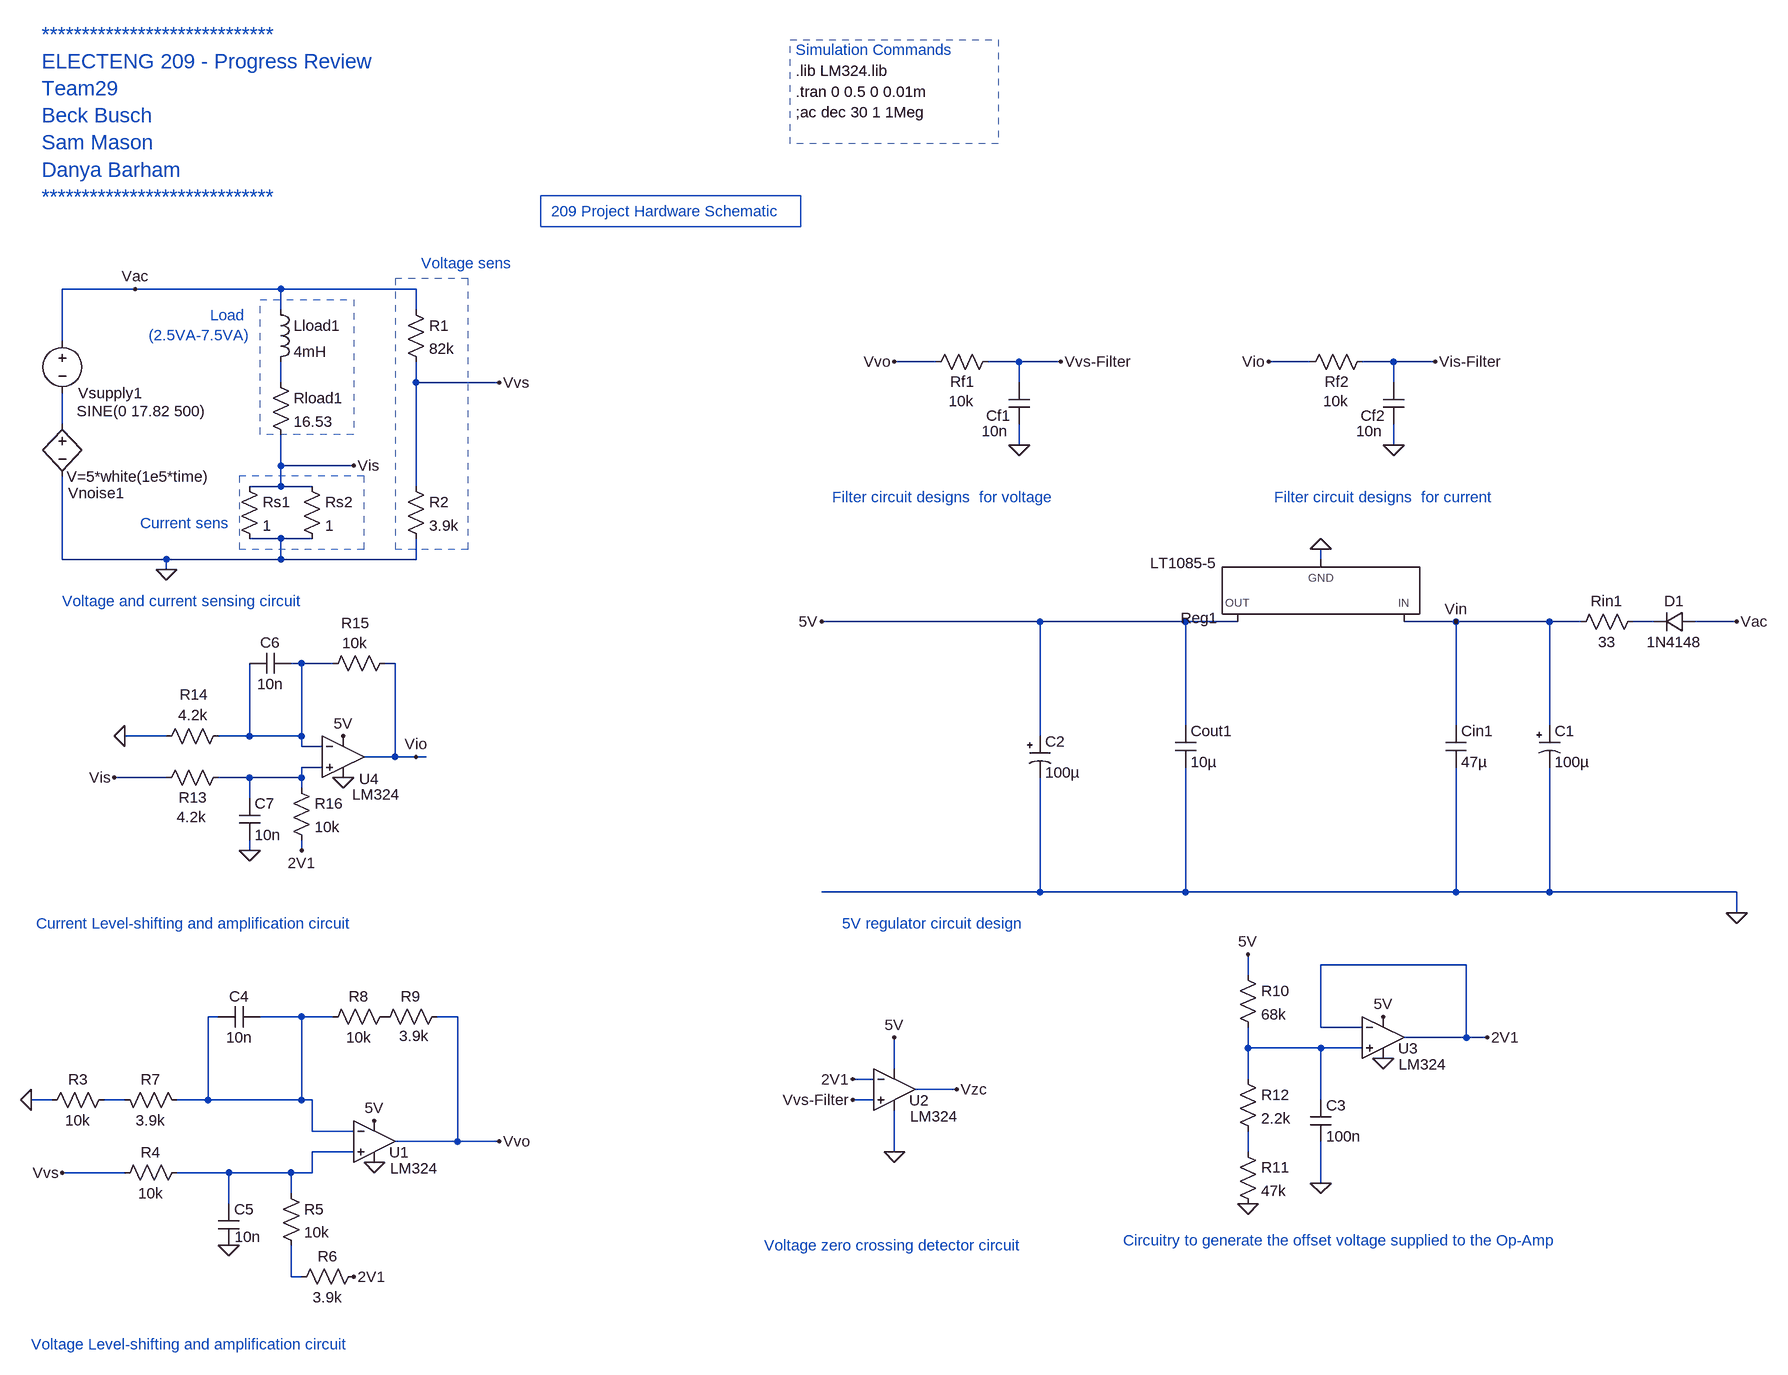
[diagram p0: schematic final-ltspice.asc]
final-ltspice.asc, the LTspice schematic file:
Version 4
SHEET 1 2620 1208
WIRE 96 -432 -16 -432
WIRE 320 -432 96 -432
WIRE 528 -432 320 -432
WIRE 320 -400 320 -432
WIRE 528 -400 528 -432
WIRE -16 -352 -16 -432
WIRE 1328 -320 1264 -320
WIRE 1456 -320 1408 -320
WIRE 1520 -320 1456 -320
WIRE 1904 -320 1840 -320
WIRE 2032 -320 1984 -320
WIRE 2096 -320 2032 -320
WIRE 320 -288 320 -320
WIRE 528 -288 528 -320
WIRE 656 -288 528 -288
WIRE 1456 -288 1456 -320
WIRE 2032 -288 2032 -320
WIRE -16 -224 -16 -272
WIRE 1456 -192 1456 -224
WIRE 2032 -192 2032 -224
WIRE 320 -160 320 -208
WIRE 432 -160 320 -160
WIRE 320 -128 320 -160
WIRE 320 -128 272 -128
WIRE 368 -128 320 -128
WIRE 528 -128 528 -288
WIRE 320 -48 272 -48
WIRE 368 -48 320 -48
WIRE -16 -16 -16 -144
WIRE 144 -16 -16 -16
WIRE 320 -16 320 -48
WIRE 320 -16 144 -16
WIRE 528 -16 528 -48
WIRE 528 -16 320 -16
WIRE 1920 -16 1920 -32
WIRE 144 0 144 -16
WIRE 1488 80 1152 80
WIRE 1712 80 1488 80
WIRE 1792 80 1712 80
WIRE 2128 80 2048 80
WIRE 2272 80 2128 80
WIRE 2320 80 2272 80
WIRE 2432 80 2400 80
WIRE 2560 80 2496 80
WIRE 352 144 336 144
WIRE 400 144 352 144
WIRE 496 144 480 144
WIRE 1712 240 1712 80
WIRE 2128 240 2128 80
WIRE 2272 240 2272 80
WIRE 144 256 80 256
WIRE 272 256 272 144
WIRE 272 256 224 256
WIRE 352 256 352 144
WIRE 352 256 272 256
WIRE 1488 256 1488 80
WIRE 352 272 352 256
WIRE 384 272 352 272
WIRE 496 288 496 144
WIRE 496 288 448 288
WIRE 528 288 496 288
WIRE 544 288 528 288
WIRE 384 304 352 304
WIRE 144 320 64 320
WIRE 272 320 224 320
WIRE 352 320 352 304
WIRE 352 320 272 320
WIRE 352 336 352 320
WIRE 272 352 272 320
WIRE 272 432 272 416
WIRE 352 432 352 416
WIRE 1488 496 1488 320
WIRE 1488 496 1152 496
WIRE 1712 496 1712 304
WIRE 1712 496 1488 496
WIRE 2128 496 2128 304
WIRE 2128 496 1712 496
WIRE 2272 496 2272 304
WIRE 2272 496 2128 496
WIRE 2560 496 2272 496
WIRE 2560 528 2560 496
WIRE 2144 608 1920 608
WIRE 1808 624 1808 592
WIRE 224 688 208 688
WIRE 352 688 288 688
WIRE 400 688 352 688
WIRE 592 688 560 688
WIRE 1920 704 1920 608
WIRE 1984 704 1920 704
WIRE 2144 720 2144 608
WIRE 2144 720 2048 720
WIRE 2176 720 2144 720
WIRE 1808 736 1808 704
WIRE 1920 736 1808 736
WIRE 1984 736 1920 736
WIRE 1264 768 1264 720
WIRE 1232 784 1200 784
WIRE 1808 784 1808 736
WIRE 1360 800 1296 800
WIRE -32 816 -64 816
WIRE 80 816 48 816
WIRE 208 816 208 688
WIRE 208 816 160 816
WIRE 352 816 352 688
WIRE 352 816 208 816
WIRE 368 816 352 816
WIRE 1232 816 1200 816
WIRE 1920 816 1920 736
WIRE 368 864 368 816
WIRE 432 864 368 864
WIRE 592 880 592 688
WIRE 592 880 496 880
WIRE 656 880 592 880
WIRE 432 896 368 896
WIRE 1264 896 1264 832
WIRE 1808 896 1808 864
WIRE 80 928 -16 928
WIRE 240 928 160 928
WIRE 336 928 240 928
WIRE 368 928 368 896
WIRE 368 928 336 928
WIRE 1920 944 1920 880
WIRE 336 960 336 928
WIRE 240 976 240 928
WIRE 240 1040 240 1024
WIRE 336 1088 336 1040
WIRE 352 1088 336 1088
FLAG 96 -432 Vac
FLAG 432 -160 Vis
FLAG 144 0 0
FLAG -64 816 0
FLAG 464 848 5V
FLAG 464 912 0
FLAG 432 1088 2V1
FLAG 656 880 Vvo
FLAG -16 928 Vvs
FLAG 656 -288 Vvs
FLAG 1456 -192 0
FLAG 1520 -320 Vvs-Filter
FLAG 2032 -192 0
FLAG 2096 -320 Vis-Filter
FLAG 1264 -320 Vvo
FLAG 1840 -320 Vio
FLAG 1152 80 5V
FLAG 1920 -32 0
FLAG 1264 896 0
FLAG 1264 720 5V
FLAG 1360 800 Vzc
FLAG 2128 80 Vin
FLAG 2560 80 Vac
FLAG 2560 528 0
FLAG 2176 720 2V1
FLAG 2016 688 5V
FLAG 2016 752 0
FLAG 1808 592 5V
FLAG 1808 976 0
FLAG 1920 944 0
FLAG 240 1040 0
FLAG 416 320 0
FLAG 416 256 5V
FLAG 528 288 Vio
FLAG 352 432 2V1
FLAG 80 256 0
FLAG 64 320 Vis
FLAG 272 432 0
FLAG 1200 784 2V1
FLAG 1200 816 Vvs-Filter
SYMBOL voltage -16 -368 R0
WINDOW 0 24 96 Left 2
WINDOW 3 22 124 Left 2
WINDOW 123 0 0 Left 0
WINDOW 39 0 0 Left 0
SYMATTR InstName Vsupply1
SYMATTR Value SINE(0 17.82 500)
SYMBOL res 304 -304 R0
SYMATTR InstName Rload1
SYMATTR Value 16.53
SYMBOL ind 304 -416 R0
SYMATTR InstName Lload1
SYMATTR Value 4mH
SYMBOL res 256 -144 R0
SYMATTR InstName Rs1
SYMATTR Value 1
SYMBOL res 352 -144 R0
SYMATTR InstName Rs2
SYMATTR Value 1
SYMBOL res 512 -416 R0
SYMATTR InstName R1
SYMATTR Value 82k
SYMBOL res 512 -144 R0
SYMATTR InstName R2
SYMATTR Value 3.9k
SYMBOL bv -16 -240 R0
WINDOW 0 9 122 Left 2
WINDOW 3 7 97 Left 2
SYMATTR InstName Vnoise1
SYMATTR Value V=5*white(1e5*time)
SYMBOL res 64 800 R90
WINDOW 0 0 56 VBottom 2
WINDOW 3 32 56 VTop 2
SYMATTR InstName R3
SYMATTR Value 10k
SYMBOL res 176 912 R90
WINDOW 0 0 56 VBottom 2
WINDOW 3 32 56 VTop 2
SYMATTR InstName R4
SYMATTR Value 10k
SYMBOL res 320 944 R0
SYMATTR InstName R5
SYMATTR Value 10k
SYMBOL res 448 1072 R90
WINDOW 0 0 56 VBottom 2
WINDOW 3 32 56 VTop 2
SYMATTR InstName R6
SYMATTR Value 3.9k
SYMBOL res 64 800 M90
WINDOW 0 0 56 VBottom 2
WINDOW 3 32 56 VTop 2
SYMATTR InstName R7
SYMATTR Value 3.9k
SYMBOL res 384 704 R270
WINDOW 0 32 56 VTop 2
WINDOW 3 0 56 VBottom 2
SYMATTR InstName R8
SYMATTR Value 10k
SYMBOL res 576 672 R90
WINDOW 0 0 56 VBottom 2
WINDOW 3 30 51 VTop 2
SYMATTR InstName R9
SYMATTR Value 3.9k
SYMBOL Opamps/opamp2 464 816 R0
WINDOW 0 23 81 Left 2
WINDOW 3 24 105 Left 2
SYMATTR InstName U1
SYMATTR Value LM324
SYMBOL res 1424 -336 R90
WINDOW 0 62 55 VBottom 2
WINDOW 3 61 57 VTop 2
SYMATTR InstName Rf1
SYMATTR Value 10k
SYMBOL cap 1472 -224 R180
WINDOW 0 29 13 Left 2
WINDOW 3 33 -11 Left 2
SYMATTR InstName Cf1
SYMATTR Value 10n
SYMBOL res 2000 -336 R90
WINDOW 0 62 55 VBottom 2
WINDOW 3 61 57 VTop 2
SYMATTR InstName Rf2
SYMATTR Value 10k
SYMBOL cap 2048 -224 R180
WINDOW 0 29 13 Left 2
WINDOW 3 33 -11 Left 2
SYMATTR InstName Cf2
SYMATTR Value 10n
SYMBOL cap 1696 240 R0
SYMATTR InstName Cout1
SYMATTR Value 10µ
SYMATTR SpiceLine Rser=0.001
SYMBOL PowerProducts/LT1085-5 1920 80 R180
SYMATTR InstName Reg1
SYMBOL Opamps/opamp2 1264 736 R0
WINDOW 0 23 81 Left 2
WINDOW 3 24 105 Left 2
SYMATTR InstName U2
SYMATTR Value LM324
SYMBOL polcap 2256 240 R0
WINDOW 3 24 56 Left 2
SYMATTR Value 100µ
SYMATTR InstName C1
SYMATTR Description Capacitor
SYMATTR Type cap
SYMATTR SpiceLine V=6.3 Irms=445m Rser=0.17 Lser=0
SYMBOL res 2304 96 R270
WINDOW 0 32 56 VTop 2
WINDOW 3 0 56 VBottom 2
SYMATTR InstName Rin1
SYMATTR Value 33
SYMBOL diode 2496 64 R90
WINDOW 0 0 32 VBottom 2
WINDOW 3 32 32 VTop 2
SYMATTR InstName D1
SYMATTR Value 1N4148
SYMBOL cap 2112 240 R0
SYMATTR InstName Cin1
SYMATTR Value 47µ
SYMATTR SpiceLine Rser=0.001
SYMBOL Opamps/opamp2 2016 656 R0
WINDOW 0 23 81 Left 2
WINDOW 3 24 105 Left 2
SYMATTR InstName U3
SYMATTR Value LM324
SYMBOL res 1792 608 R0
SYMATTR InstName R10
SYMATTR Value 68k
SYMBOL res 1792 880 R0
SYMATTR InstName R11
SYMATTR Value 47k
SYMBOL res 1792 768 R0
SYMATTR InstName R12
SYMATTR Value 2.2k
SYMBOL cap 1904 816 R0
SYMATTR InstName C3
SYMATTR Value 100n
SYMBOL cap 288 672 R90
WINDOW 0 0 32 VBottom 2
WINDOW 3 32 32 VTop 2
SYMATTR InstName C4
SYMATTR Value 10n
SYMBOL cap 224 976 R0
WINDOW 3 25 51 Left 2
SYMATTR Value 10n
SYMATTR InstName C5
SYMBOL Opamps/opamp2 416 224 R0
WINDOW 0 25 98 Left 2
WINDOW 3 14 122 Left 2
SYMATTR InstName U4
SYMATTR Value LM324
SYMBOL res 240 304 R90
WINDOW 0 62 55 VBottom 2
WINDOW 3 61 57 VTop 2
SYMATTR InstName R13
SYMATTR Value 4.2k
SYMBOL res 240 240 R90
WINDOW 0 -32 53 VBottom 2
WINDOW 3 -32 55 VTop 2
SYMATTR InstName R14
SYMATTR Value 4.2k
SYMBOL res 496 128 R90
WINDOW 0 -30 61 VBottom 2
WINDOW 3 -31 62 VTop 2
SYMATTR InstName R15
SYMATTR Value 10k
SYMBOL res 336 320 R0
SYMATTR InstName R16
SYMATTR Value 10k
SYMBOL cap 336 128 R90
WINDOW 0 0 32 VBottom 2
WINDOW 3 32 32 VTop 2
SYMATTR InstName C6
SYMATTR Value 10n
SYMBOL cap 256 352 R0
SYMATTR InstName C7
SYMATTR Value 10n
SYMBOL polcap 1472 256 R0
WINDOW 3 24 56 Left 2
SYMATTR Value 100µ
SYMATTR InstName C2
SYMATTR Description Capacitor
SYMATTR Type cap
SYMATTR SpiceLine V=6.3 Irms=175m Rser=0.65 Lser=0 mfg="Panasonic" pn="ECA0JFQ101" type="Al electrolytic"
TEXT -48 -824 Left 3 ;*****************************\nELECTENG 209 - Progress Review\nTeam29\nBeck Busch\nSam Mason\nDanya Barham\n*****************************
TEXT 272 -392 Right 2 ;Load \n(2.5VA-7.5VA)
TEXT 1112 -704 Left 2 !;ac dec 30 1 1Meg
TEXT 1112 -800 Left 2 ;Simulation Commands
TEXT 1112 -736 Left 2 !.tran 0 0.5 0 0.01m
TEXT 1112 -768 Left 2 !.lib LM324.lib
TEXT -16 48 Left 2 ;Voltage and current sensing circuit
TEXT -56 544 Left 2 ;Current Level-shifting and amplification circuit
TEXT -64 1192 Left 2 ;Voltage Level-shifting and amplification circuit
TEXT 1168 -112 Left 2 ;Filter circuit designs  for voltage
TEXT 1848 -112 Left 2 ;Filter circuit designs  for current
TEXT 1184 544 Left 2 ;5V regulator circuit design
TEXT 1616 1032 Left 2 ;Circuitry to generate the offset voltage supplied to the Op-Amp
TEXT 1064 1040 Left 2 ;Voltage zero crossing detector circuit
TEXT 104 -72 Left 2 ;Current sens
TEXT 536 -472 Left 2 ;Voltage sens
TEXT 736 -552 Left 2 ;209 Project Hardware Schematic
RECTANGLE Normal 1424 -656 1104 -816 2
RECTANGLE Normal 432 -208 288 -416 2
RECTANGLE Normal 256 -32 448 -144 2
RECTANGLE Normal 608 -448 496 -32 2
RECTANGLE Normal 1120 -528 720 -576

The netlist it stands for:
* final-ltspice.asc
Vsupply1 Vac N002 SINE(0 17.82 500)
Rload1 N001 Vis 16.53
Lload1 Vac N001 4mH
Rs1 Vis 0 1
Rs2 Vis 0 1
R1 Vac Vvs 82k
R2 Vvs 0 3.9k
B§Vnoise1 N002 0 V=5*white(1e5*time)
R3 N008 0 10k
R4 N009 Vvs 10k
R5 N009 N011 10k
R6 2V1 N011 3.9k
R7 N008 N006 3.9k
R8 N006 P001 10k
R9 Vvo P001 3.9k
XU1 N009 N006 5V 0 Vvo LM324  ; pins In+ In- V+ V- OUT
Rf1 Vvs-Filter Vvo 10k
Cf1 0 Vvs-Filter 10n
Rf2 Vis-Filter Vio 10k
Cf2 0 Vis-Filter 10n
Cout1 5V 0 10µ Rser=0.001
XReg1 0 5V Vin LT1085-5  ; pins GND OUT IN
XU2 Vvs-Filter 2V1 5V 0 Vzc LM324  ; pins In+ In- V+ V- OUT
C1 Vin 0 100µ V=6.3 Irms=445m Rser=0.17 Lser=0
Rin1 Vin N003 33
D1 Vac N003 1N4148
Cin1 Vin 0 47µ Rser=0.001
XU3 N007 2V1 5V 0 2V1 LM324  ; pins In+ In- V+ V- OUT
R10 5V N007 68k
R11 N010 0 47k
R12 N007 N010 2.2k
C3 N007 0 100n
C4 N006 N006 10n
C5 N009 0 10n
XU4 N005 N004 5V 0 Vio LM324  ; pins In+ In- V+ V- OUT
R13 N005 Vis 4.2k
R14 N004 0 4.2k
R15 Vio N004 10k
R16 N005 2V1 10k
C6 N004 N004 10n
C7 N005 0 10n
C2 5V 0 100µ V=6.3 Irms=175m Rser=0.65 Lser=0 mfg="Panasonic" pn="ECA0JFQ101" type="Al electrolytic"
.model D D
.lib standard.dio
* *****************************
* ELECTENG 209 - Progress Review
* Team29
* Beck Busch
* Sam Mason
* Danya Barham
* *****************************
* Load
* (2.5VA-7.5VA)
;ac dec 30 1 1Meg
* Simulation Commands
.tran 0 0.5 0 0.01m
.lib LM324.lib
* Voltage and current sensing circuit
* Current Level-shifting and amplification circuit
* Voltage Level-shifting and amplification circuit
* Filter circuit designs  for voltage
* Filter circuit designs  for current
* 5V regulator circuit design
* Circuitry to generate the offset voltage supplied to the Op-Amp
* Voltage zero crossing detector circuit
* Current sens
* Voltage sens
* 209 Project Hardware Schematic
.backanno
.end